# Altium schematic sheet Display.SchDoc
size 431 x 279 mm; Organization: ORGANIZATION; Address1: ADDRESS 1; Address2: ADDRESS 2; Address3: ADDRESS 3; Address4: ADDRESS 4; Revision: -; SheetNumber: 4; SheetTotal: 7; ENG_APP_DATE: --/--/--; DSN_APP_DATE: --/--/--; CHK_APP_DATE: --/--/--
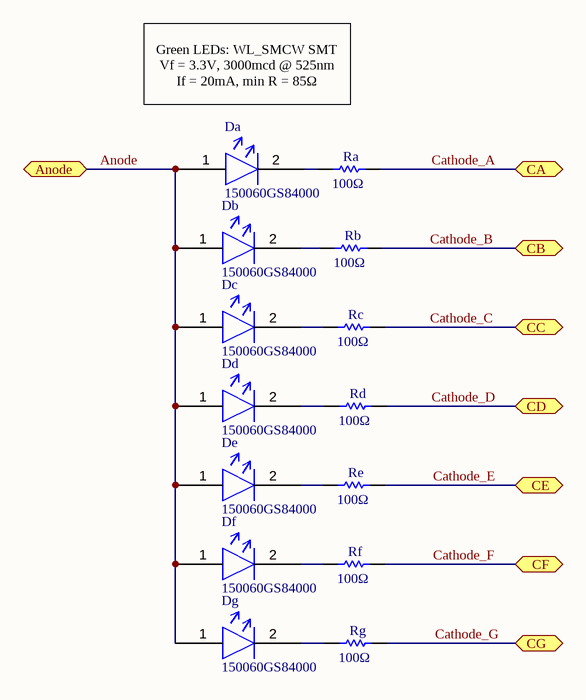
[diagram p0: Display.SchDoc]

## Parts
Da  150060GS84000  [DIOC2408X10N]
Db  150060GS84000  [DIOC2408X10N]
Dc  150060GS84000  [DIOC2408X10N]
Dd  150060GS84000  [DIOC2408X10N]
De  150060GS84000  [DIOC2408X10N]
Df  150060GS84000  [DIOC2408X10N]
Dg  150060GS84000  [DIOC2408X10N]
Ra  value 100Ω  [RESC1005X40X25NL05T10]  (hidden comment: RC0402FR-13100RL)
Rb  value 100Ω  [RESC1005X40X25NL05T10]  (hidden comment: RC0402FR-13100RL)
Rc  value 100Ω  [RESC1005X40X25NL05T10]  (hidden comment: RC0402FR-13100RL)
Rd  value 100Ω  [RESC1005X40X25NL05T10]  (hidden comment: RC0402FR-13100RL)
Re  value 100Ω  [RESC1005X40X25NL05T10]  (hidden comment: RC0402FR-13100RL)
Rf  value 100Ω  [RESC1005X40X25NL05T10]  (hidden comment: RC0402FR-13100RL)
Rg  value 100Ω  [RESC1005X40X25NL05T10]  (hidden comment: RC0402FR-13100RL)

## Ports
Anode (bidir), CA (bidir), CB (bidir), CC (bidir), CD (bidir), CE (bidir), CF (bidir), CG (bidir)

## Nets
Anode: Da.1(+) Db.1(+) Dc.1(+) Dd.1(+) De.1(+) Df.1(+) Dg.1(+) ; port Anode
Cathode_A: Ra.2 ; port CA
Cathode_B: Rb.2 ; port CB
Cathode_C: Rc.2 ; port CC
Cathode_D: Rd.2 ; port CD
Cathode_E: Re.2 ; port CE
Cathode_F: Rf.2 ; port CF
Cathode_G: Rg.2 ; port CG
NetDa_2: Da.2(-) Ra.1
NetDb_2: Db.2(-) Rb.1
NetDc_2: Dc.2(-) Rc.1
NetDd_2: Dd.2(-) Rd.1
NetDe_2: De.2(-) Re.1
NetDf_2: Df.2(-) Rf.1
NetDg_2: Dg.2(-) Rg.1

## Notes on the sheet
- Green LEDs: WL_SMCW SMT
  Vf = 3.3V, 3000mcd @ 525nm
  If = 20mA, min R = 85Ω
- DWG. NO.
- REV.
- SHT.
- THIS DOCUMENT AND THE DATA DISCLOSED HEREIN OR HEREWITH IS THE PROPERTY OF ALTIUM LIMITED AND MAY BE FREELY DISTRIBUTED IN WHOLE. NO RIGHTS ARE RESERVED OR EXPRESS OR IMPLIED WARANTEE GIVEN.
- REVISION
- DESCRIPTION
- DATE
- APPROVED
- ENG:
- APPROVALS
- PROJECT
- DSN:
- CHK:
- REFERENCE DOCUMENTS
- PROJECT REVISION:
- TITLE
- DOCUMENT REVISION:
- DESIGN ITEM:
- BOM:
- FAB DWG:
- PCB DWG:
- ASSY DWG:
- SCALE:
- SIZE
- B
- CAGE CODE
- FILE NAME
- DWG NO.
- SHEET
- OF
- REV

## Library data of the parts
Da Db Dc Dd De Df Dg = CMP-00009-2: Wl-smcw SMT Mono-color Chip Led
Ra Rb Rc Rd Re Rf Rg = CMP-2002-07853-1: Manufacturer: Yageo; Part Number: RC0402FR-13100RL